# EAGLE schematic tl494-orig (EAGLE 9.4.2)
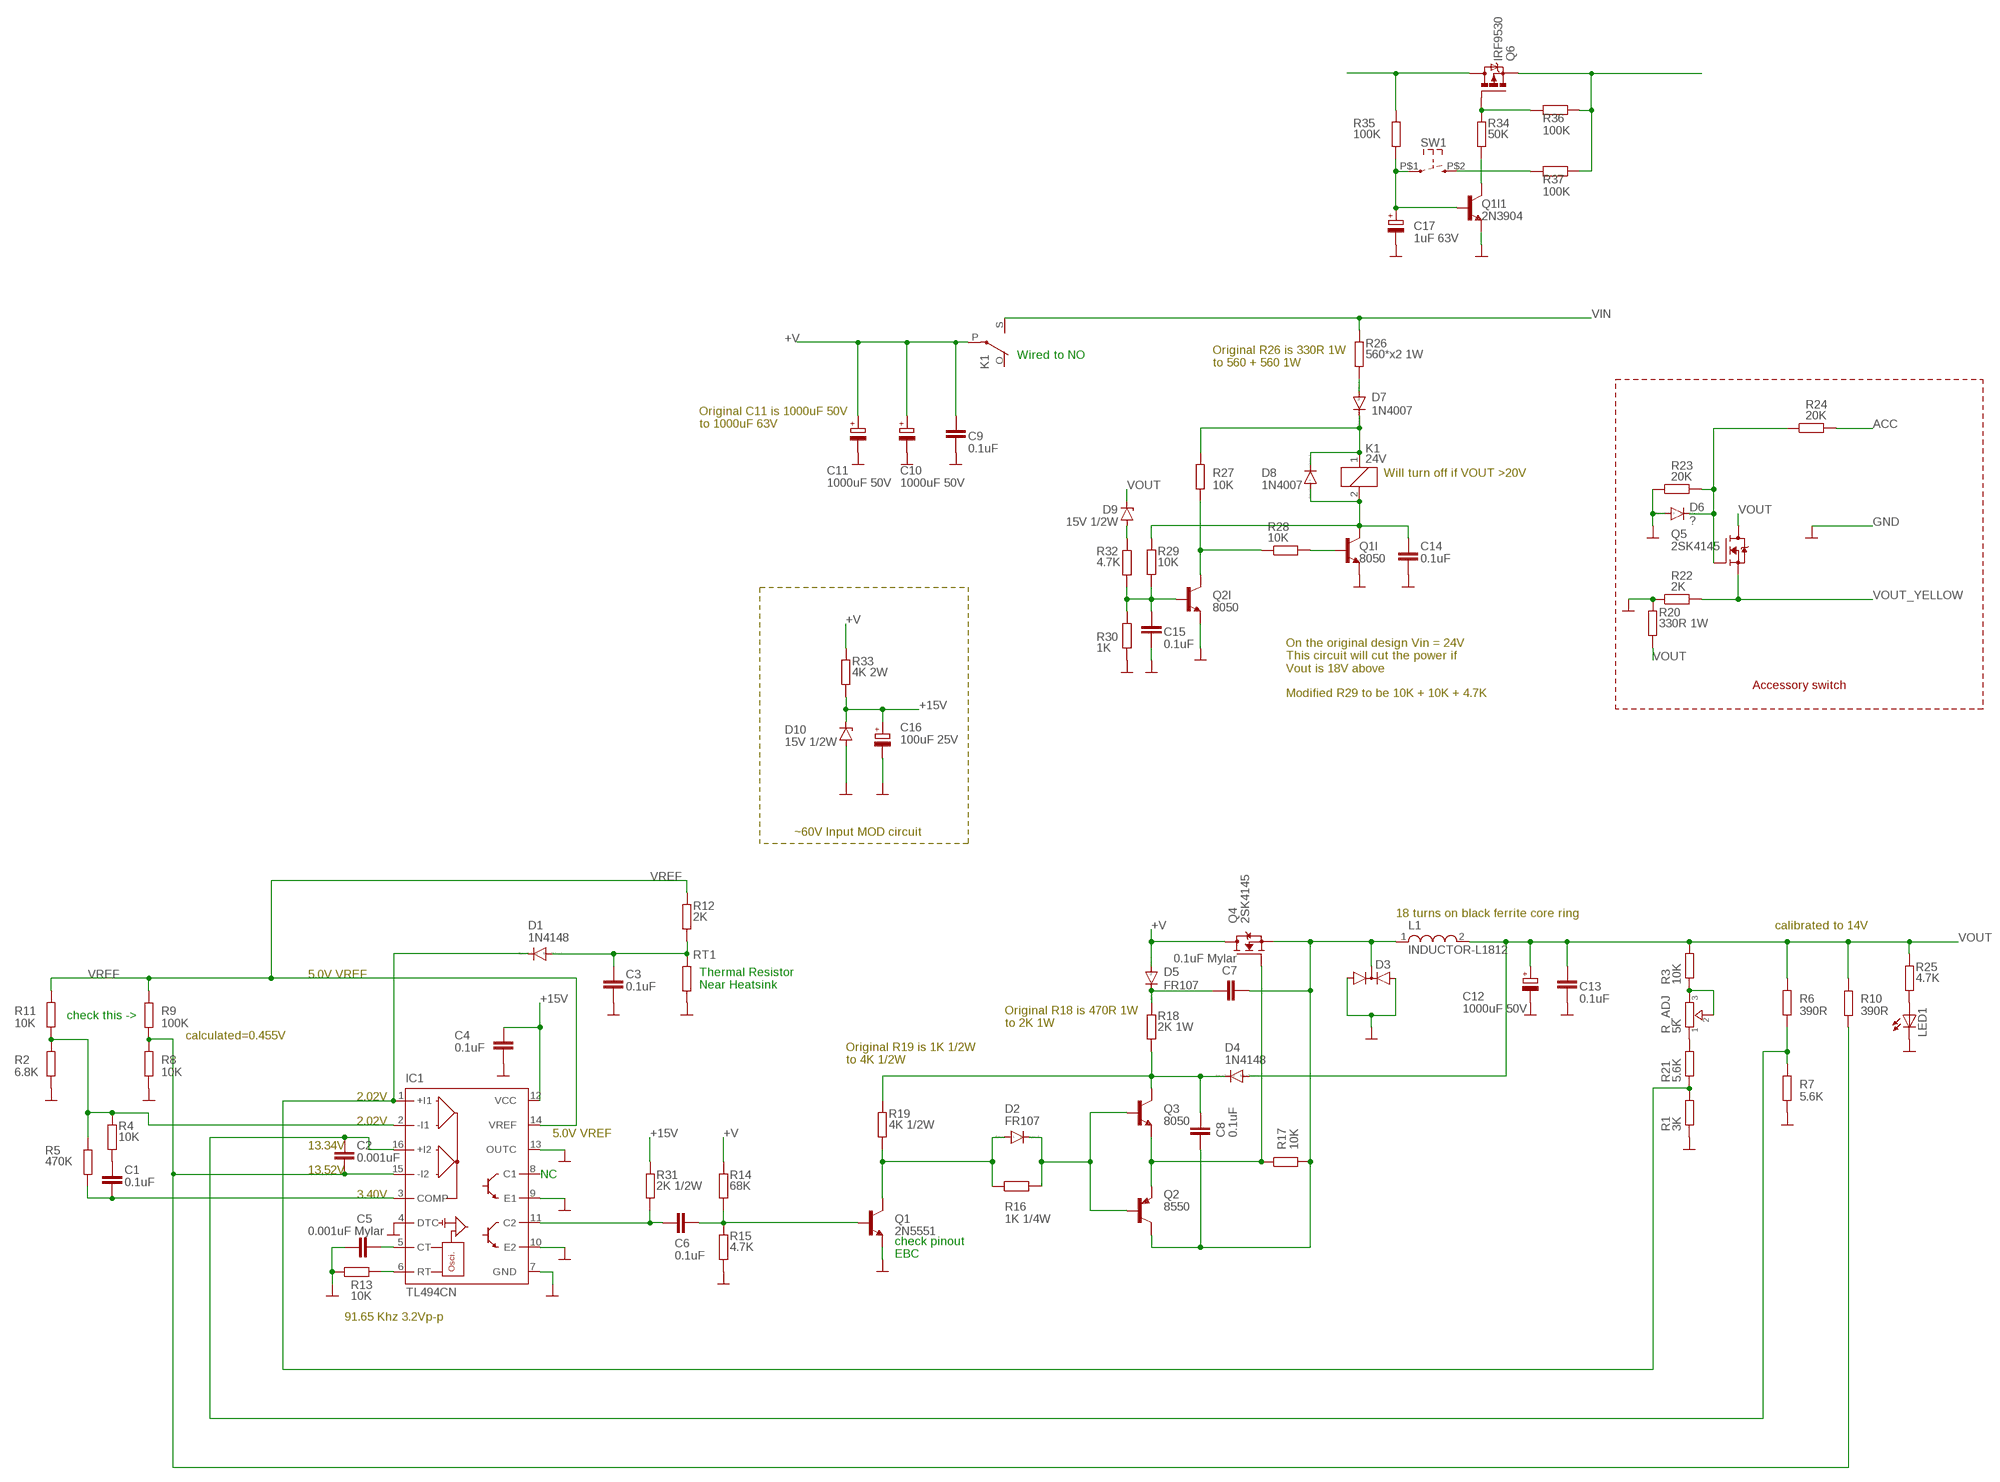
[diagram p0: schematic, sheet 1]

## Parts
C1  0.1uF  C-EU050-024X044  [C050-024X044]
C2  0.001uF  C-EU050-024X044  [C050-024X044]
C3  0.1uF  C-EU050-024X044  [C050-024X044]
C4  0.1uF  C-EU050-024X044  [C050-024X044]
C5  0.001uF Mylar  C-EU050-024X044  [C050-024X044]
C6  0.1uF  C-EU050-024X044  [C050-024X044]
C7  0.1uF Mylar  C-EU050-050X075  [C050-050X075]
C8  0.1uF  C-EU050-024X044  [C050-024X044]
C9  0.1uF  C-EU050-024X044  [C050-024X044]
C10  1000uF 50V  CPOL-EUE3.5-10  [E3,5-10]
C11  1000uF 50V  CPOL-EUE3.5-10  [E3,5-10]
C12  1000uF 50V  CPOL-EUE3.5-10  [E3,5-10]
C13  0.1uF  C-EU050-024X044  [C050-024X044]
C14  0.1uF  C-EU050-024X044  [C050-024X044]
C15  0.1uF  C-EU050-024X044  [C050-024X044]
C16  100uF 25V  CPOL-EUE2.5-7  [E2,5-7]
C17  1uF 63V  CPOL-EUE3.5-10  [E3,5-10]
D1  1N4148  1N4148DO35-10  [DO35-10]
D2  FR107  1N4933  [DO41-10]
D3  DIODE-2AC|CATO220V  [TO220ABS]
D4  1N4148  1N4148DO35-10  [DO35-10]
D5  FR107  1N4933  [DO41-10]
D6  ?  1N4148DO35-10  [DO35-10]
D7  1N4007  1N4933  [DO41-10]
D8  1N4007  1N4933  [DO41-10]
D9  15V 1/2W  BZV10  [DO34Z7]
D10  15V 1/2W  BZV10  [DO34Z7]
IC1  TL494CN  [DIL16]
K1  24V  G2R  [G2R]
L1  INDUCTOR-L1812  [L1812]
LED1  LED-5MM  [LED-5MM]
Q1  2N5551  TRANSISTOR_BJT_NPN-TO-92-EBC  [TO-92]
Q1I  8050  TRANSISTOR_BJT_NPN-TO-92-EBC  [TO-92]
Q1I1  2N3904  TRANSISTOR_BJT_NPN-TO-92-EBC  [TO-92]
Q2  8550  TRANSISTOR_BJT_PNP-TO-92-EBC  [TO-92]
Q2I  8050  TRANSISTOR_BJT_NPN-TO-92-EBC  [TO-92]
Q3  8050  TRANSISTOR_BJT_NPN-TO-92-EBC  [TO-92]
Q4  2SK4145  TRANSISTOR_MOSFET-N-TO220V  [TO-220V]
Q5  2SK4145  TRANSISTOR_MOSFET-N-TO220V  [TO-220V]
Q6  IRF9530  [TO220BV]
R1  3K  R-EU_0207/10  [0207/10]
R2  6.8K  R-EU_0207/10  [0207/10]
R3  10K  R-EU_0207/10  [0207/10]
R4  10K  R-EU_0207/10  [0207/10]
R5  470K  R-EU_0207/10  [0207/10]
R6  390R  R-EU_0207/10  [0207/10]
R7  5.6K  R-EU_0207/10  [0207/10]
R8  10K  R-EU_0207/10  [0207/10]
R9  100K  R-EU_0207/10  [0207/10]
R10  390R  R-EU_0207/10  [0207/10]
R11  10K  R-EU_0207/10  [0207/10]
R12  2K  R-EU_0207/10  [0207/10]
R13  10K  R-EU_0207/2V  [0207/2V]
R14  68K  R-EU_0207/10  [0207/10]
R15  4.7K  R-EU_0207/10  [0207/10]
R16  1K 1/4W  R-EU_0207/10  [0207/10]
R17  10K  R-EU_0207/10  [0207/10]
R18  2K 1W  R-EU_0207/10  [0207/10]
R19  4K 1/2W  R-EU_0207/10  [0207/10]
R20  330R 1W  R-EU_0207/10  [0207/10]
R21  5.6K  R-EU_0207/10  [0207/10]
R22  2K  R-EU_0207/10  [0207/10]
R23  20K  R-EU_0207/10  [0207/10]
R24  20K  R-EU_0207/10  [0207/10]
R25  4.7K  R-EU_0207/10  [0207/10]
R26  560*x2 1W  R-EU_0207/10  [0207/10]
R27  10K  R-EU_0207/10  [0207/10]
R28  10K  R-EU_0207/10  [0207/10]
R29  10K  R-EU_0207/10  [0207/10]
R30  1K  R-EU_0207/10  [0207/10]
R31  2K 1/2W  R-EU_0207/10  [0207/10]
R32  4.7K  R-EU_0207/10  [0207/10]
R33  4K 2W  R-EU_0414/5V  [0414V]
R34  50K  R-EU_0207/10  [0207/10]
R35  100K  R-EU_0207/10  [0207/10]
R36  100K  R-EU_0207/10  [0207/10]
R37  100K  R-EU_0207/10  [0207/10]
R_ADJ  5K  TRIMMER-3362P  [TRIMMER_3362P]
RT1  R-EU_0207/2V  [0207/2V]
SW1  SW_MEMBRANE  [SW_MEMBRANE]

## Nets
+15V: C4.2 C16.+ D10.C IC1.12(VCC) R31.2 R33.1
+V: C9.1 C10.+ C11.+ D5.A K1.P(2:P) Q4.2(D) R14.2 R33.2
ACC: R24.2
GND: C3.1 C4.1 C5.2 C9.2 C10.- C11.- C12.- C13.2 C14.2 C15.2 C16.- C17.- D3.A1 D3.A2 D6.A D10.A IC1.4(DTC) IC1.7(GND) IC1.9(E1) IC1.10(E2) IC1.13(OUTC) LED1.K(C) Q1.1(E) Q1I1.1(E) Q1I.1(E) Q2I.1(E) R1.1 R2.1 R7.1 R8.1 R13.1 R15.1 R20.2 R22.1 R23.1 R30.1 RT1.2 ; supply symbol labelled SUPPLY_GND
N$1: C2.2 IC1.16(+I2) R6.1 R7.2
N$2: R3.1 R_ADJ.2 R_ADJ.3
N$3: R21.2 R_ADJ.1
N$4: IC1.2(-I1) R2.2 R4.2 R5.1 R11.1
N$5: C1.2 R4.1
N$6: C1.1 IC1.3(COMP) R5.2
N$7: D1.C IC1.1(+I1) R1.2 R21.1
N$8: C2.1 IC1.15(-I2) R8.2 R9.2 R10.2
N$9: C3.2 D1.A R12.1 RT1.1
N$10: C6.2 IC1.11(C2) R31.1
N$11: C5.1 IC1.5(CT)
N$12: IC1.6(RT) R13.2
N$13: C6.1 Q1.2(B) R14.1 R15.2
N$14: D2.A Q1.3(C) R16.1 R19.1
N$15: D2.C Q2.2(B) Q3.2(B) R16.2
N$16: Q2.1(E) Q3.1(E) Q4.1(G) R17.1
N$17: C7.2 C8.2 D3.C L1.1 Q2.3(C) Q4.3(S) R17.2
N$18: C8.1 D4.C Q3.3(C) R18.1 R19.2
N$19: C7.1 D5.C R18.2
N$20: D6.C Q5.1(G) R23.2 R24.1
N$21: LED1.A R25.1
N$22: D7.A R26.1
N$23: D7.C D8.C K1.1 R27.2
N$24: C14.1 D8.A K1.2 Q1I.3(C) R29.2
N$25: Q2I.3(C) R27.1 R28.1
N$26: Q1I.2(B) R28.2
N$27: C15.1 Q2I.2(B) R29.1 R30.2 R32.2
N$28: D9.A R32.1
N$29: Q6.S R36.1 R37.1
N$30: Q6.G R34.2 R36.2
N$31: Q1I1.3(C) R34.1
N$32: Q6.D R35.2
N$33: C17.+ Q1I1.2(B) R35.1 SW1.P$1
N$34: R37.2 SW1.P$2
VIN: K1.S(2:S) R26.2
VOUT: C12.+ C13.1 D4.A D9.C L1.2 Q5.2(D) R3.2 R6.2 R10.1 R20.1 R25.2
VOUT_YELLOW: Q5.3(S) R22.2
VREF: IC1.14(VREF) R9.1 R11.2 R12.2
Unconnected: IC1.8(C1) K1.O(2:O)

## Notes on the sheet
- Wired to NO
- Original R26 is 330R 1W
  to 560 + 560 1W
- Original C11 is 1000uF 50V
  to 1000uF 63V
- Will turn off if VOUT >20V
- On the original design Vin = 24V
  This circuit will cut the power if
  Vout is 18V above
- Accessory switch
- Modified R29 to be 10K + 10K + 4.7K
- ~60V Input MOD circuit
- 18 turns on black ferrite core ring
- calibrated to 14V
- 5.0V VREF
- Thermal Resistor
  Near Heatsink
- check this ->
- Original R18 is 470R 1W
  to 2K 1W
- calculated=0.455V
- Original R19 is 1K 1/2W
  to 4K 1/2W
- 2.02V
- 2.02V
- 5.0V VREF
- 13.34V
- 13.52V | NC
- 3.40V
- check pinout
  EBC
- 91.65 Khz 3.2Vp-p

## Library data of the parts
C1-C9 C13-C15 = rcl:C-EU: CAPACITOR, European symbol; SPICEPREFIX: C
C10-C12 C16 C17 = rcl:CPOL-EU: POLARIZED CAPACITOR, European symbol; SPICEPREFIX: C
D1 D4 D6 = diode:1N4148: DIODE high speed (Philips)
D2 D5 D7 D8 = diode:1N4933: DIODE fast recovery rectifier, 1A
D3 = diode:DIODE-2AC|CA: Dual DIODE Anode-Cathode|Cathode-Anode
D9 D10 = diode:BZV10: Z DIODE
IC1 = linear:TL494*: SWITCHMODE Pulse Width Modulation Control Circuit NCV494B http://onsemi.com tl494-d.pdf
K1 = relay:G2R: RELAY 1 x switch, Omron; OC_FARNELL: 1569185; OC_NEWARK: unknown
L1 = dp_devices.v6:INDUCTOR: Inductor
LED1 = dp_devices.v6:LED: Light Emitting Diode
Q1 Q1I Q1I1 Q2I Q3 = dp_devices.v6:TRANSISTOR_BJT_NPN: Most commonly used is SOT23-BEC
Q2 = dp_devices.v6:TRANSISTOR_BJT_PNP: Most commonly used is SOT23-BEC
Q4 Q5 = dp_devices.v6:TRANSISTOR_MOSFET-N
Q6 = transistor-power:IRF9530: P-CHANNEL HEXFET POWER-MOS-FET Source: http://www.irf.com/product-info/datasheets/data/irf9530.pdf
R1-R37 RT1 = rcl:R-EU_: RESISTOR, European symbol; SPICEPREFIX: R
R_ADJ = dp_devices.v6:TRIMMER: Trimmer resistor
SW1 = dp_devices.v6:SW_MEMBRANE